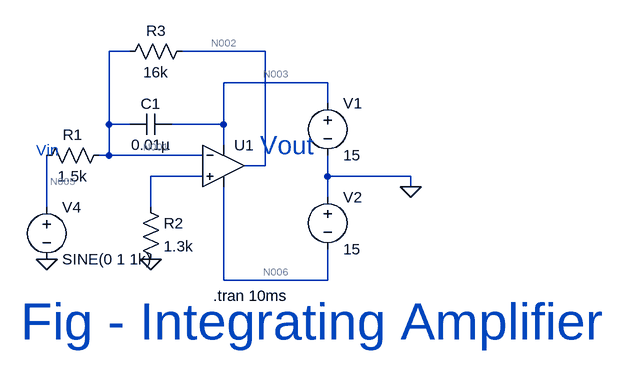
[diagram p0: schematic Prac-10 Integrator.asc]
Prac-10 Integrator.asc, the LTspice schematic file:
Version 4
SHEET 1 880 680
WIRE 64 32 32 32
WIRE 272 32 144 32
WIRE 368 80 208 80
WIRE 368 112 368 80
WIRE 32 144 32 32
WIRE 64 144 32 144
WIRE 208 144 208 80
WIRE 208 144 128 144
WIRE 208 176 208 144
WIRE 32 192 32 144
WIRE 32 192 16 192
WIRE 176 192 32 192
WIRE 272 208 272 32
WIRE 272 208 240 208
WIRE 176 224 96 224
WIRE 368 224 368 192
WIRE 496 224 368 224
WIRE 496 240 496 224
WIRE 368 256 368 224
WIRE -64 272 -64 192
WIRE 96 272 96 224
WIRE 208 384 208 240
WIRE 368 384 368 336
WIRE 368 384 208 384
FLAG 496 240 0
FLAG 96 352 0
FLAG -64 352 0
SYMBOL voltage 368 96 R0
SYMATTR InstName V1
SYMATTR Value 15
SYMBOL voltage 368 240 R0
SYMATTR InstName V2
SYMATTR Value 15
SYMBOL voltage -64 256 R0
WINDOW 123 0 0 Left 0
WINDOW 39 0 0 Left 0
SYMATTR InstName V4
SYMATTR Value SINE(0 1 1k)
SYMBOL res 32 176 R90
WINDOW 0 0 56 VBottom 2
WINDOW 3 32 56 VTop 2
SYMATTR InstName R1
SYMATTR Value 1.5k
SYMBOL res 80 256 R0
SYMATTR InstName R2
SYMATTR Value 1.3k
SYMBOL res 160 16 R90
WINDOW 0 0 56 VBottom 2
WINDOW 3 32 56 VTop 2
SYMATTR InstName R3
SYMATTR Value 16k
SYMBOL OpAmps\\UniversalOpAmp 208 208 R0
SYMATTR InstName U1
SYMBOL cap 128 128 R90
WINDOW 0 0 32 VBottom 2
WINDOW 3 32 32 VTop 2
SYMATTR InstName C1
SYMATTR Value 0.01µ
TEXT -104 448 Left 6 ;Fig - Integrating Amplifier
TEXT 192 408 Left 2 !.tran 10ms
TEXT -80 184 Left 2 ;Vin
TEXT 264 176 Left 4 ;Vout

The netlist it stands for:
* Prac-10 Integrator.asc
V1 N003 0 15
V2 0 N006 15
V4 N005 0 SINE(0 1 1k)
R1 N001 N005 1.5k
R2 N004 0 1.3k
R3 N002 N001 16k
XU1 N004 N001 N003 N006 N002 level1 Avol=1Meg GBW=10Meg Vos=0 En=0 Enk=0 In=0 Ink=0 Rin=500Meg  ; pins In+ In- V+ V- OUT
C1 N003 N001 0.01µ
* Fig - Integrating Amplifier
.tran 10ms
* Vin
* Vout
.lib UniversalOpAmp1.lib
.backanno
.end

* Results of the author's LTspice run, read from the files saved beside the schematic
* Operating Point, zero values left out:
*   V(n003) = 15 V
*   V(n006) = -15 V
*   I(V1) = -30 nA
*   I(V2) = -30 nA
*   Ix(u1:3) = 30 nA
*   Ix(u1:4) = -30 nA
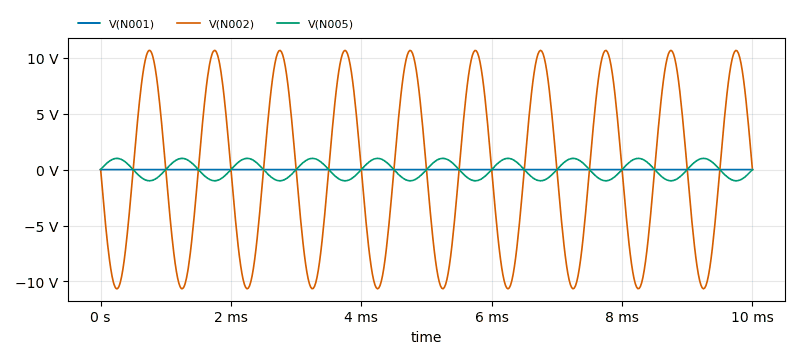
[diagram p1: Transient Analysis of Prac-10 Integrator.asc, plotted from the saved traces]
* Transient Analysis, 1 run:
*   V(N001): min -1.073 mV, max 1.477 mV, average -74.97 nV, rms 753.9 µV, last 1.067 mV
*   V(N002): min -10.66 V, max 10.66 V, average -47.88 µV, rms 7.537 V, last 12.46 mV
*   V(N005): min -1 V, max 1 V, average 7.184 µV, rms 707.2 mV, last 0 V